# Altium schematic sheet Charge.SchDoc
size A4
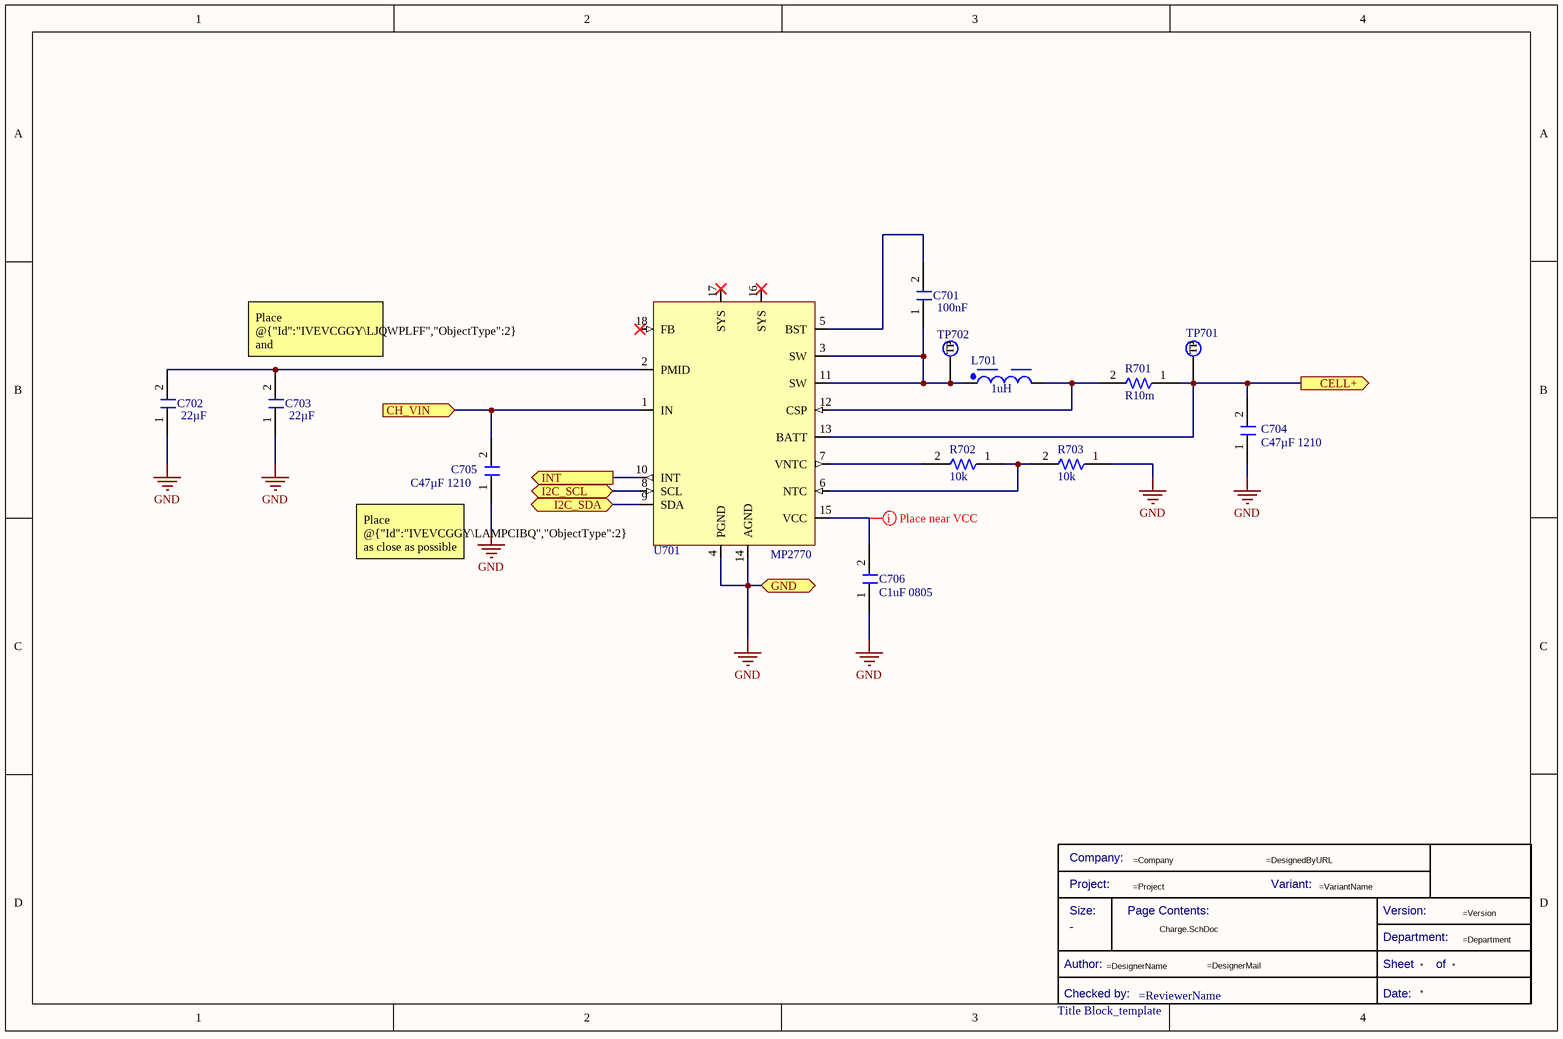
[diagram p0: Charge.SchDoc]

## Parts
*  Title Block_template  (graphical)
C701  value 100nF  [CAPC1608X92X38LL15T08]  (hidden comment: C100nF-25V-0603)
C702  value 22µF  [WCAP-CSGP_0805_L2W1.25H0.8_Reflow]  (hidden comment: C22uF-25V-0805)
C703  value 22µF  [WCAP-CSGP_0805_L2W1.25H0.8_Reflow]  (hidden comment: C22uF-25V-0805)
C704  C47µF 1210  [FP-GRM32E-0_3-0_2-IPC_C]
C705  C47µF 1210  [FP-GRM32E-0_3-0_2-IPC_C]
C706  C1uF 0805  [WCAP-CSGP_0805_L2W1.25H1.25]
L701  value 1uH  [WE-PD_7345]  (hidden comment: L1uH_120V_8A)
R701  value R10m  [WRIS-RSKS_1206_Wave]  (hidden comment: R10m-1206)
R702  value 10k  [R0805FTK]  (hidden comment: R10k-0805FTK)
R703  value 10k  [R0805FTK]  (hidden comment: R10k-0805FTK)
TP701  TestPoint  [TestPoint]  (value not drawn)  (no BOM)
TP702  TestPoint  [TestPoint]  (value not drawn)  (no BOM)
U701  MP2770  [MP2770]

## Ports
CELL+ (out), CH_VIN (in), GND (bidir), I2C_SCL (bidir), I2C_SDA (bidir), INT (out)

## Nets
GND: C702.1 C703.1 C704.1 C705.1 C706.1 R703.1 U701.4(PGND) U701.14(AGND) ; port GND
CELL+: C704.2 R701.1 TP701.1(TP) U701.13(BATT) ; port CELL+
CH_VIN: C705.2 U701.1(IN) ; port CH_VIN
I2C_SCL: U701.8(SCL) ; port I2C_SCL
I2C_SDA: U701.9(SDA) ; port I2C_SDA
INT: U701.10(INT) ; port INT
NetC701_1: C701.1 L701.1 TP702.1(TP) U701.3(SW) U701.11(SW)
NetC701_2: C701.2 U701.5(BST)
NetC702_2: C702.2 C703.2 U701.2(PMID)
NetC706_2: C706.2 U701.15(VCC)
NetL701_2: L701.2 R701.2 U701.12(CSP)
NetR702_1: R702.1 R703.2 U701.6(NTC)
NetR702_2: R702.2 U701.7(VNTC)

Not connected (* = marked no-connect by the designer): U701 16(SYS)* 17(SYS)* 18(FB)*

## Layout directives
mark named Place near VCC: NetC706_2

## Notes on the sheet
- (near C703) Place @{"Id":"IVEVCGGY\LJQWPLFF","ObjectType":2} and @{"Id":"IVEVCGGY\PTQDCIFI","ObjectType":2} as close as possible to the IC
- (near C705) Place @{"Id":"IVEVCGGY\LAMPCIBQ","ObjectType":2} as close as possible to the IC
- (in symbol CMP-00043-7) Company:; Project:; Variant:; Size:; Page Contents:; Version:; Department:; Author:; Sheet; of; Checked by:; Date:

## Library data of the parts
* = CMP-00043-7: Standard Title Block; .Creator: GP; Checked by:: =ReviewerName; Size: -; Design Item ID: Title Block_template; Category: Title Block; .SCHcheck: GP; Source: e-Tech_Racing.SchLib; .PCBcheck: GP
C701 = CMP-001-00026-1: Ceramic Capacitor, Multilayer, Ceramic, 25V, 5% +Tol, 5% -Tol, X7R, 15% TC, 0.1uF, Surface Mount, 0603. PN: VJ0603Y104JXXAC.; Capacitor Type: Ceramic; RoHS Compliant: Yes; Pins: 2; Max Operating Temperature: 125°C; Min Operating Temperature: -55°C; Case/Package: 0603; Mounting Technology: Surface Mount
C702 C703 = CMP-001-00029-1: Ceramic Capacitor, Multilayer, Ceramic, 25V, 20% +Tol, 20% -Tol, X5R, 15% TC, 22uF, Surface Mount, 0805. PN: C2012X5R1E226M125AC.; Case/Package: 0805; Mounting Technology: Surface Mount; Min Operating Temperature: -55°C; Capacitor Type: Ceramic; Pins: 2; RoHS Compliant: Yes; Max Operating Temperature: 85°C
C704 C705 = CMP-001-00003-4: Ceramic Capacitor, Multilayer, Ceramic, 10V, 10% +Tol, 10% -Tol, X6S, 22% TC, 47uF, Surface Mount, 1210; Value: 47µF; Capacitor Type: Ceramic; Min Operating Temperature: -55°C; Pins: 2; RoHS Compliant: Yes; Case/Package: 1210; Max Operating Temperature: 105°C; Mounting Technology: Surface Mount
C706 = CMP-001-00010-5: Ceramic Capacitor, Multilayer, Ceramic, 16V, 10% +Tol, 10% -Tol, X7R, 15% TC, 1uF, Surface Mount, 0805; Capacitor Type: Ceramic; Pins: 2; RoHS Compliant: Yes
L701 = CMP-006-00008-1: General Purpose Inductor, 1uH, 40%, 1 Element, Ferrite-Core, SMD, 2929. PN: 744777001; Max Current Rating: 8A; Self Resonant Frequency: 90MHz; Tolerance: 40%; Max Operating Temperature: 125°C; Min Operating Temperature: -40°C; RoHS Compliant: Yes; Pins: 2
R701 = CMP-009-00047-1: Fixed Resistor, Metal Strip, 0.25W, 0.01ohm, 0.05V, 1% +/-Tol, 75ppm/Cel, Surface Mount, 1206. PN: WSL1206R0100FEK; Power: 250mW; Pins: 2; Case/Package: 1206; RoHS Compliant: Yes; Min Operating Temperature: -65°C; Tolerance: 1%; Max Operating Temperature: 170°C; Mounting Technology: Surface Mount
R702 R703 = CMP-00085-4: BOURNS         CR0805-JW-103ELF            Surface Mount Chip Resistor, Thick Film, CR Series, 10 kohm, 125 mW,  5%, 150 V; Voltage Rating: 150V; Voltage Rating (DC): 100V; Max Power Dissipation: 125mW; Temperature Coefficient: 200ppm/°C; .Creator: DR; Depth: 1.25mm; Package Quantity: 1; ComponentLink6Description: https://datasheet.ciiva.com/16783/70154685-16783482.pdf?src-supplier=Allied+Electronics; Max Operating Temperature: 155°C; ComponentLink8Description: https://datasheet.ciiva.com/6559/chpreztr-6559900.pdf?src-supplier=Digi-Key; ComponentLink3URL: https://datasheet.ciiva.com/22693/1902866-22693254.pdf?src-supplier=Element14; ComponentLink2URL: https://datasheet.ciiva.com/9122/chpreztr-9122374.pdf?src-supplier=Avnet; REACH SVHC: No SVHC; ComponentLink9Description: https://datasheet.ciiva.com/6559/chpreztr-6559901.pdf?src-supplier=Digi-Key; ComponentLink1URL: https://datasheet.ciiva.com/11821/0900766b80fcdb72-11821135.pdf?src-supplier=RSComponents; Manufacturer Part Number 1: CR0805-JW-103ELF; ComponentLink8URL: https://datasheet.ciiva.com/6559/chpreztr-6559900.pdf?src-supplier=Digi-Key; Length: 2mm; ComponentLink10Description: https://datasheet.ciiva.com/7985/1856384-7985869.pdf?src-supplier=Element14; Case/Package: 0805; ComponentLink5Description: https://datasheet.ciiva.com/30065/159chpreztr-30065976.pdf?src-supplier=Onlinecomponents.com; Design Item ID: R10k-0805FTK; ComponentLink1Description: https://datasheet.ciiva.com/11821/0900766b80fcdb72-11821135.pdf?src-supplier=RSComponents; Number of Terminations: 2; Radiation Hardening: No; Resistance Tolerance: 5%; ComponentLink4Description: https://datasheet.ciiva.com/7986/691949-7986187.pdf?src-supplier=Element14; ComponentLink3Description: https://datasheet.ciiva.com/22693/1902866-22693254.pdf?src-supplier=Element14; Packaging: Tape and Reel; ComponentLink6URL: https://datasheet.ciiva.com/16783/70154685-16783482.pdf?src-supplier=Allied+Electronics; Pins: 2; ComponentLink5URL: https://datasheet.ciiva.com/30065/159chpreztr-30065976.pdf?src-supplier=Onlinecomponents.com; Mount: Surface Mount; ComponentLink11URL: https://datasheet.ciiva.com/48692/001055517-da-01-en-smd-wid-cr0805-jw-103elf-10k-ohm-1-8w-48692118.pdf?src-supplier=Conrad; ComponentLink11Description: https://datasheet.ciiva.com/48692/001055517-da-01-en-smd-wid-cr0805-jw-103elf-10k-ohm-1-8w-48692118.pdf?src-supplier=Conrad; Military Standard: Not; Power Rating: 125mW; Thickness: 508um; Source: Passives.SchLib; Min Operating Temperature: -55°C; Manufacturer 1: Bourns; Resistor Type: Thick Film; ComponentLink7URL: https://datasheet.ciiva.com/5548/chpreztr-5548491.pdf?src-supplier=Mouser; ComponentLink2Description: https://datasheet.ciiva.com/9122/chpreztr-9122374.pdf?src-supplier=Avnet; Termination: SMD/SMT; Features: Moisture Resistant; ComponentLink4URL: https://datasheet.ciiva.com/7986/691949-7986187.pdf?src-supplier=Element14; RoHS Compliant: Yes; ComponentLink9URL: https://datasheet.ciiva.com/6559/chpreztr-6559901.pdf?src-supplier=Digi-Key; Technology: THICK FILM; ComponentLink10URL: https://datasheet.ciiva.com/7985/1856384-7985869.pdf?src-supplier=Element14; Height: 0.5mm; Category: Chip SMD Resistors; RoHS: Yes; Series: CR0805; Pricing 1: 1=0,05790, 10=0,01540, 25=0,01340, 100=0,00340 (USD); Stock 1: 57566; ComponentLink7Description: https://datasheet.ciiva.com/5548/chpreztr-5548491.pdf?src-supplier=Mouser; Case Code (Metric): 2012; Contact Plating: Tin; Tolerance: 5%; Construction: Rectangular; Width: 1.25mm
TP701 TP702 = CMP-00042-1: Test Point 1x1 mm; .SCHcheck: GP; Category: TestPoint; Source: e-Tech_Racing.SchLib; .Creator: GP; .PCBcheck: GP; Design Item ID: TestPoint
U701 = CMP-00029-00002-7: 6A, 1-Cell Switching Charger with Power Path Management and 3.65A Boost Output; ComponentLink1Description: Datasheet; ComponentLink1URL: https://www.monolithicpower.com/en/documentview/productdocument/index/version/2/document_type/Datasheet/lang/en/sku/MP2770GL/document_id/10545/